# EAGLE design M205X (EAGLE 6.6.0)
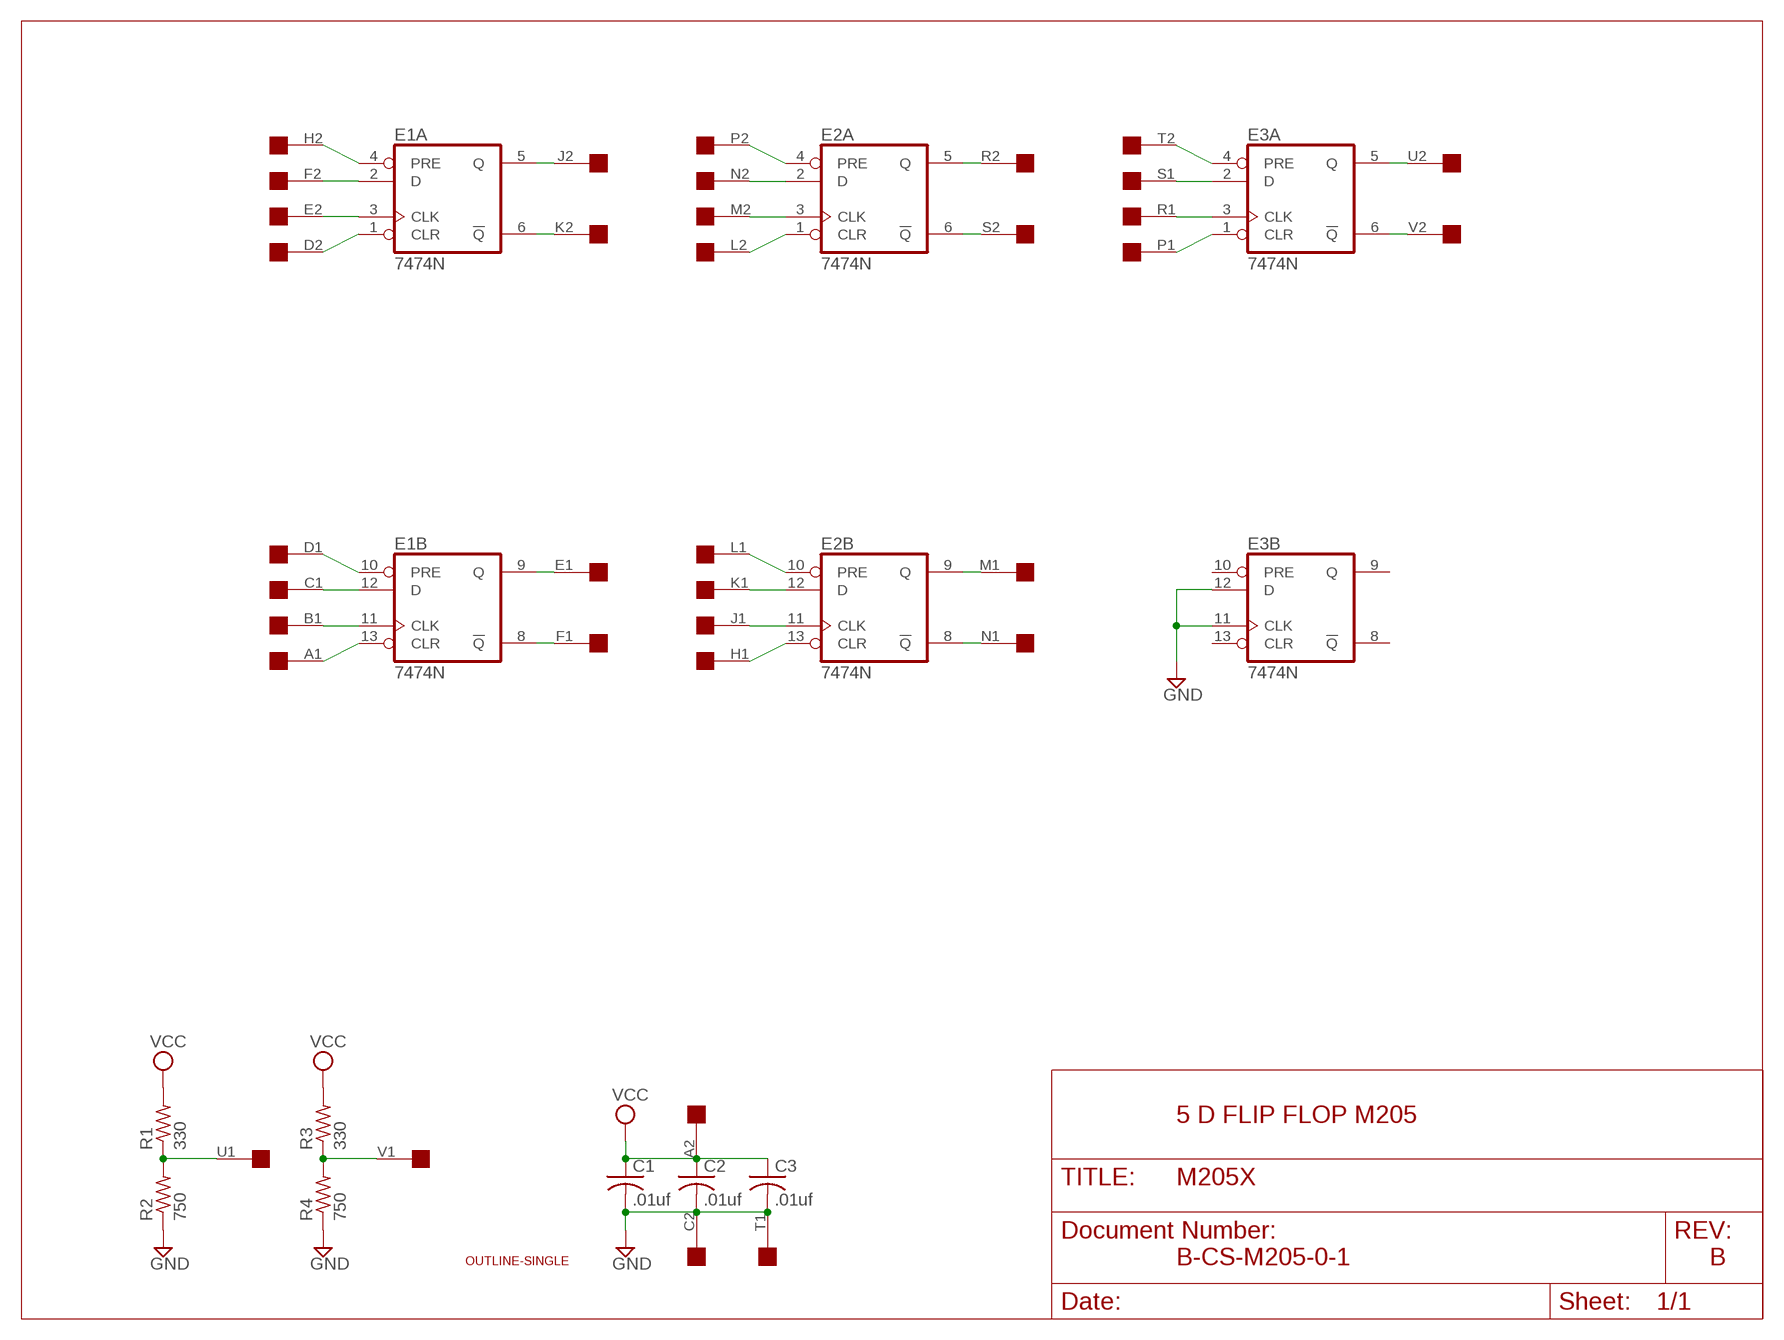
[diagram p0: schematic, sheet 1]

## Parts
C1  .01uf  C-US050-025X075  [C050-025X075]
C2  .01uf  C-US050-025X075  [C050-025X075]
C3  .01uf  C-US050-025X075  [C050-025X075]
E1  7474N  74S74N  [DIL14]
E2  7474N  74S74N  [DIL14]
E3  7474N  74S74N  [DIL14]
R1  330  R-US_0207/10  [0207/10]
R2  750  R-US_0207/10  [0207/10]
R3  330  R-US_0207/10  [0207/10]
R4  750  R-US_0207/10  [0207/10]
U$1  OUTLINE-SINGLE  [SINGLE]
U$2  EDGE-2CONNECTOR  [EDGE-CON2]

## Nets
GND [Supply]: C1.2 C2.2 C3.2 E3.11(B:CLK) E3.12(B:D) R2.1 R4.1 U$2.C2 U$2.T1
N$1: R1.1 R2.2 U$2.U1
N$2: R3.1 R4.2 U$2.V1
N$3: E1.6(A:!Q) U$2.K2
N$4: E1.5(A:Q) U$2.J2
N$5: E1.2(A:D) U$2.F2
N$6: E1.4(A:PRE) U$2.H2
N$7: E1.3(A:CLK) U$2.E2
N$8: E1.1(A:CLR) U$2.D2
N$9: E2.1(A:CLR) U$2.L2
N$10: E2.3(A:CLK) U$2.M2
N$11: E2.2(A:D) U$2.N2
N$12: E2.4(A:PRE) U$2.P2
N$13: E2.6(A:!Q) U$2.S2
N$14: E2.5(A:Q) U$2.R2
N$15: E3.1(A:CLR) U$2.P1
N$16: E3.3(A:CLK) U$2.R1
N$17: E3.2(A:D) U$2.S1
N$18: E3.6(A:!Q) U$2.V2
N$19: E3.5(A:Q) U$2.U2
N$20: E3.4(A:PRE) U$2.T2
N$21: E1.13(B:CLR) U$2.A1
N$22: E1.11(B:CLK) U$2.B1
N$23: E1.10(B:PRE) U$2.D1
N$24: E1.8(B:!Q) U$2.F1
N$25: E1.9(B:Q) U$2.E1
N$26: E1.12(B:D) U$2.C1
N$27: E2.13(B:CLR) U$2.H1
N$28: E2.11(B:CLK) U$2.J1
N$29: E2.12(B:D) U$2.K1
N$30: E2.10(B:PRE) U$2.L1
N$31: E2.9(B:Q) U$2.M1
N$32: E2.8(B:!Q) U$2.N1
VCC [Supply]: C1.1 C2.1 C3.1 R1.2 R3.2 U$2.A2
Unconnected: E3.8(B:!Q) E3.9(B:Q) E3.10(B:PRE) E3.13(B:CLR) U$2.B2

## Notes on the sheet
- 5 D FLIP FLOP M205
- B-CS-M205-0-1 | B

## Power pins joined to a net without a drawn wire
GND: E1.7(P:GND) E2.7(P:GND) E3.7(P:GND)
VCC: E1.14(P:VCC) E2.14(P:VCC) E3.14(P:VCC)

## Library data of the parts
C1-C3 = rcl:C-US: CAPACITOR, American symbol
E1-E3 = 74xx-us:74*74: Dual D type positive edge triggered FLIP FLOP, preset and clear
R1-R4 = rcl:R-US_: RESISTOR, American symbol
U$1 = dec-con:OUTLINE-*: Board outlines for DEC boards.
U$2 = dec-con:EDGE-2: Double-Sided DEC edge connector.

## Net classes
1 Supply: width 0.813 mm

## Board
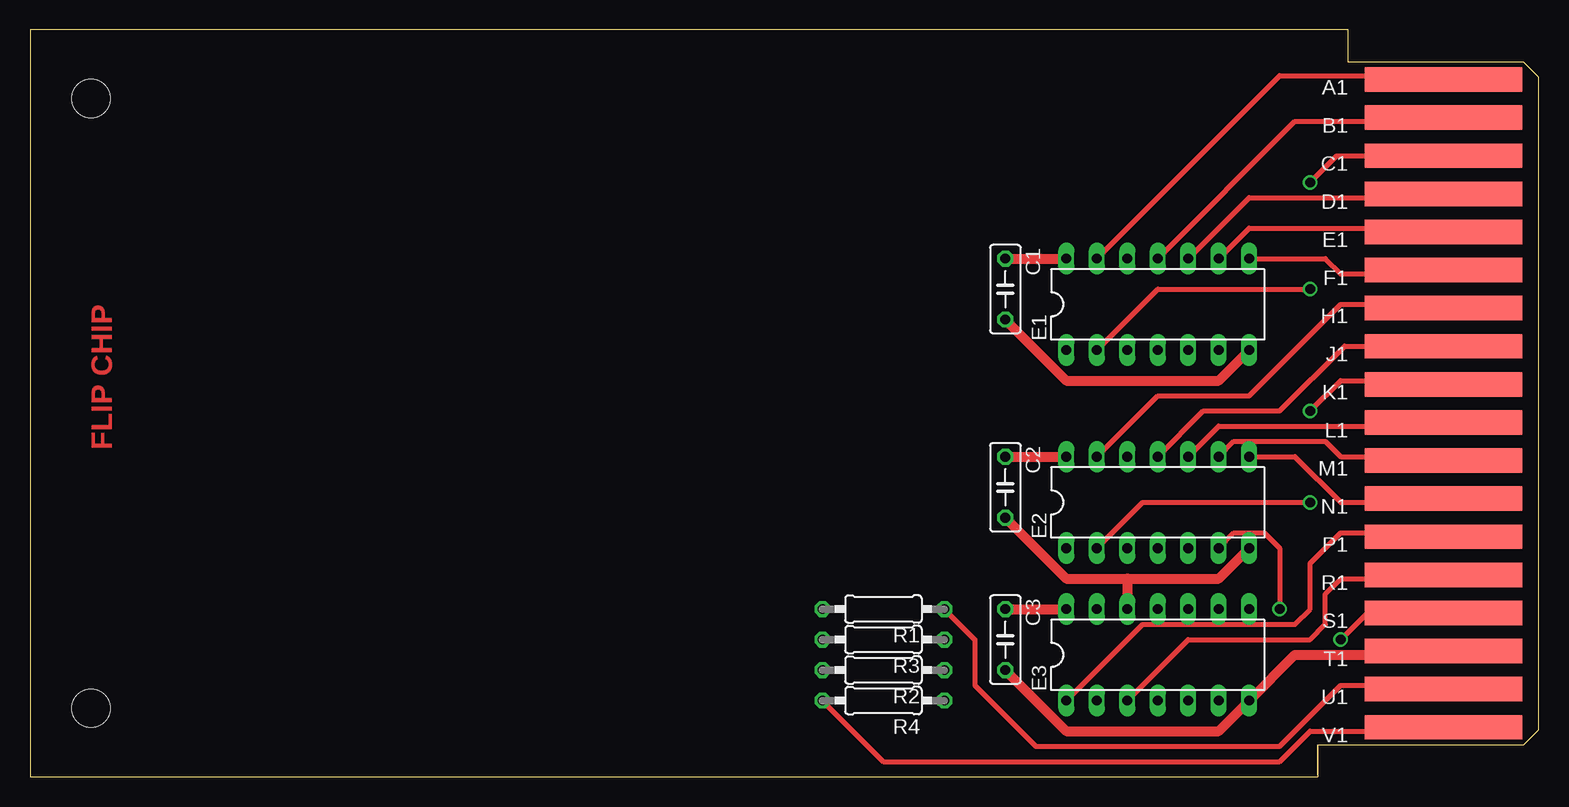
[diagram p1: board, top side]
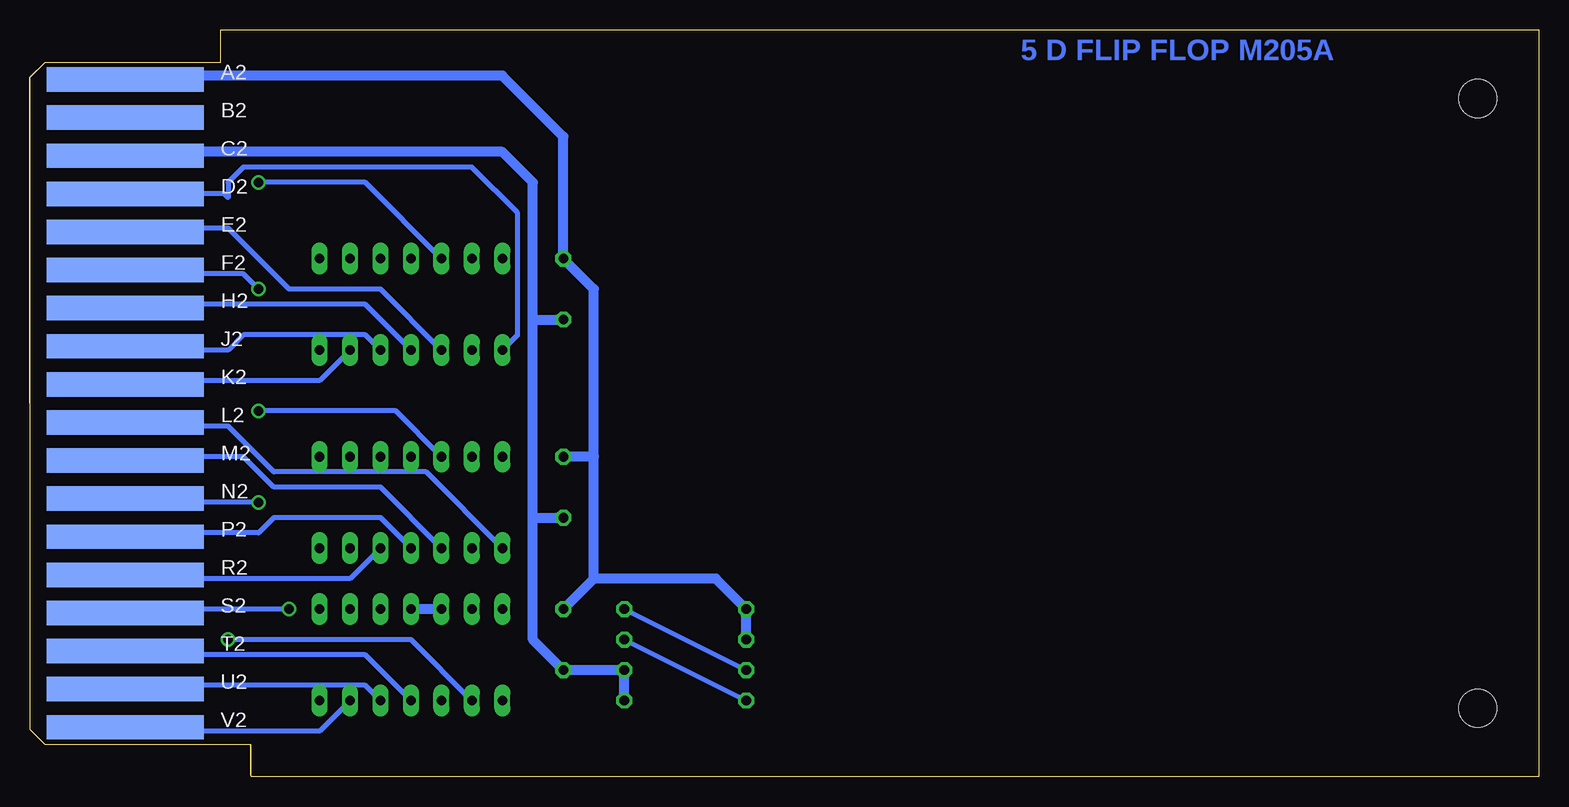
[diagram p2: board, bottom side, seen from below]

Size 125.73 x 62.23 mm. Coordinates in mm from the lower left corner, seen from the top.
Copper layers (1+16): Top 0.035mm / dielectric 1.5mm / Bottom 0.035mm
Design rules "16mils": minimum track width 16mil, minimum drill 32mil, track to track 15mil, track to pad 10mil, pad to pad 10mil, via to via 10mil, smd to smd 10mil, copper to edge 13mil, drill to drill 10mil, minimum pad ring 10mil, minimum via ring 8mil, stop-mask expansion 0mil, vias tented up to drill 0mil, thermal gap 10mil

### Footprints (pad centres in the part's own frame; a part is rotated, then mirrored left to right if it is on the bottom)
C050-025X075 = drill 0.813 octagon: 1 -2.54,0; 2 2.54,0
DIL14 = drill 0.813 long: 1 -7.62,-3.81; 2 -5.08,-3.81; 3 -2.54,-3.81; 4 0,-3.81; 5 2.54,-3.81; 6 5.08,-3.81; 7 7.62,-3.81; 8 7.62,3.81; 9 5.08,3.81; 10 2.54,3.81; 11 0,3.81; 12 -2.54,3.81; 13 -5.08,3.81; 14 -7.62,3.81
0207/10 = drill 0.813 octagon: 1 -5.08,0; 2 5.08,0
SINGLE = hole 3.175: 120.65,56.515; 120.65,5.715
EDGE-CON2 = smd 13.106 x 2.032: A1 7.938,4.128; B1 7.938,7.303; C1 7.938,10.477; D1 7.938,13.652; E1 7.938,16.828; F1 7.938,20.003; H1 7.938,23.177; J1 7.938,26.352; K1 7.938,29.527; L1 7.938,32.703; M1 7.938,35.877; N1 7.938,39.053; P1 7.938,42.227; R1 7.938,45.403; S1 7.938,48.578; T1 7.938,51.752; U1 7.938,54.928; V1 7.938,58.102 | smd 13.106 x 2.032 bottom: A2 7.938,4.128; B2 7.938,7.303; C2 7.938,10.477; D2 7.938,13.652; E2 7.938,16.828; F2 7.938,20.003; H2 7.938,23.177; J2 7.938,26.352; K2 7.938,29.527; L2 7.938,32.703; M2 7.938,35.877; N2 7.938,39.053; P2 7.938,42.227; R2 7.938,45.403; S2 7.938,48.578; T2 7.938,51.752; U2 7.938,54.928; V2 7.938,58.102

### Placement (x,y rotation side)
C1  81.28,40.64 270 top
C2  81.28,24.13 270 top
C3  81.28,11.43 270 top
E1  93.98,39.37 0 top
E2  93.98,22.86 0 top
E3  93.98,10.16 0 top
R1  71.12,13.97 180 top
R2  71.12,8.89 180 top
R3  71.12,11.43 180 top
R4  71.12,6.35 180 top
U$1  125.73,62.23 180 top
U$2  125.73,62.23 180 top

### Tracks (layer width: path | path; a pad name or v marks a point on that pad's centre or on a via)
GND
  Top 0.813: E2.7 99.06,16.51 91.44,16.51 | 91.44,16.51 86.36,16.51 C2.2 | 91.44,16.51 E3.12 | C3.2 86.36,3.81 99.06,3.81 E3.7 105.41,10.16 111.76,10.16 U$2.T1 | E1.7 99.06,33.02 86.36,33.02 C1.2
  Bottom 0.813: R2.1 R4.1 R2.1 | R2.1 C3.2 83.82,11.43 83.82,21.59 | 83.82,21.59 83.82,38.1 | 83.82,38.1 83.82,49.53 86.36,52.07 111.76,52.07 U$2.C2 | 83.82,38.1 C1.2 | 83.82,21.59 C2.2 | E3.12 E3.11
N$1
  Top 0.406: U$2.U1 112.12,7.26 111.76,7.62 109.22,7.62 104.14,2.54 83.82,2.54 78.74,7.62 78.74,11.43 R1.1
  Bottom 0.406: R2.2 R1.1
N$2
  Top 0.406: U$2.V1 112.15,4.2 111.76,3.81 106.68,3.81 104.14,1.27 71.12,1.27 R4.2
  Bottom 0.406: R4.2 R3.1
N$3
  Bottom 0.406: E1.6 101.6,33.02 111.76,33.02 112.06,32.72 U$2.K2
N$4
  Bottom 0.406: U$2.J2 112.09,35.89 111.76,35.56 109.22,35.56 107.95,36.83 97.79,36.83 E1.5
N$5  (via drill 0.81)
  Top 0.406: E1.2 93.98,40.64 v106.68,40.64
  Bottom 0.406: U$2.F2 112.04,42.19 111.76,41.91 107.95,41.91 v106.68,40.64
N$6
  Bottom 0.406: U$2.H2 112.09,39.04 111.76,39.37 97.79,39.37 E1.4
N$7
  Bottom 0.406: U$2.E2 112.09,45.39 111.76,45.72 109.22,45.72 104.14,40.64 96.52,40.64 E1.3
N$8
  Bottom 0.406: U$2.D2 109.53,48.56 109.22,48.26 109.22,49.53 107.95,50.8 88.9,50.8 85.09,46.99 85.09,36.83 E1.1
N$9
  Bottom 0.406: U$2.L2 111.76,29.21 109.22,29.21 105.41,25.4 92.71,25.4 E2.1
N$10
  Bottom 0.406: U$2.M2 112.09,26.34 111.76,26.67 107.95,26.67 105.41,24.13 96.52,24.13 E2.3
N$11  (via drill 0.81)
  Top 0.406: v106.68,22.86 92.71,22.86 E2.2
  Bottom 0.406: U$2.N2 112.09,23.19 111.76,22.86 v106.68,22.86
N$12
  Bottom 0.406: U$2.P2 112.09,19.99 111.76,20.32 106.68,20.32 105.41,21.59 96.52,21.59 E2.4
N$13  (via drill 0.81)
  Top 0.406: E2.6 100.33,20.32 102.87,20.32 104.14,19.05 v104.14,13.97
  Bottom 0.406: U$2.S2 112.06,13.66 111.76,13.97 v104.14,13.97
N$14
  Bottom 0.406: U$2.R2 112.09,16.84 111.76,16.51 99.06,16.51 E2.5
N$15
  Top 0.406: U$2.P1 112.09,19.99 111.76,20.32 109.22,20.32 106.68,17.78 106.68,13.97 105.41,12.7 92.71,12.7 E3.1
N$16
  Top 0.406: U$2.R1 112.09,16.84 111.76,16.51 109.22,16.51 107.95,15.24 107.95,12.7 106.68,11.43 96.52,11.43 E3.3
N$17  (via drill 0.81)
  Top 0.406: U$2.S1 112.06,13.66 111.76,13.97 v109.22,11.43
  Bottom 0.406: v109.22,11.43 93.98,11.43 E3.2
N$18
  Bottom 0.406: U$2.V2 112.15,4.2 111.76,3.81 101.6,3.81 E3.6
N$19
  Bottom 0.406: U$2.U2 112.12,7.26 111.76,7.62 97.79,7.62 E3.5
N$20
  Bottom 0.406: U$2.T2 112.09,10.49 111.76,10.16 97.79,10.16 E3.4
N$21
  Top 0.406: U$2.A1 111.76,58.42 104.14,58.42 E1.13
N$22
  Top 0.406: U$2.B1 112.05,54.9 111.76,54.61 105.41,54.61 E1.11
N$23
  Top 0.406: U$2.D1 112.06,48.56 111.76,48.26 101.6,48.26 E1.10
N$24
  Top 0.406: U$2.F1 112.04,42.19 111.76,41.91 109.22,41.91 107.95,43.18 E1.8
N$25
  Top 0.406: U$2.E1 112.09,45.39 111.76,45.72 101.6,45.72 E1.9
N$26  (via drill 0.81)
  Top 0.406: U$2.C1 108.89,51.74 v106.68,49.53
  Bottom 0.406: v106.68,49.53 97.79,49.53 E1.12
N$27
  Top 0.406: U$2.H1 112.09,39.04 111.76,39.37 109.22,39.37 101.6,31.75 93.98,31.75 E2.13
N$28
  Top 0.406: U$2.J1 109.55,35.89 104.14,30.48 97.79,30.48 E2.11
N$29  (via drill 0.81)
  Top 0.406: U$2.K1 112.06,32.72 111.76,33.02 109.22,33.02 v106.68,30.48
  Bottom 0.406: v106.68,30.48 95.25,30.48 E2.12
N$30
  Top 0.406: U$2.L1 112.09,29.54 111.76,29.21 99.06,29.21 E2.10
N$31
  Top 0.406: U$2.M1 112.09,26.34 111.76,26.67 109.22,26.67 107.95,27.94 100.33,27.94 E2.9
N$32
  Top 0.406: U$2.N1 112.09,23.19 111.76,22.86 109.22,22.86 105.41,26.67 E2.8
VCC
  Top 0.813: C1.1 E1.14 | C2.1 E2.14 | C3.1 E3.14
  Bottom 0.813: U$2.A2 111.76,58.42 86.36,58.42 81.28,53.34 C1.1 78.74,40.64 78.74,26.67 | 78.74,16.51 78.74,26.67 | 78.74,16.51 C3.1 | 78.74,26.67 C2.1 | 78.74,16.51 68.58,16.51 R1.2 | R1.2 R3.2 R1.2

### Text on the board
Top: FLIP CHIP
Bottom: 5 D FLIP FLOP M205A